# EAGLE design Ekspander (EAGLE 9.3.0)
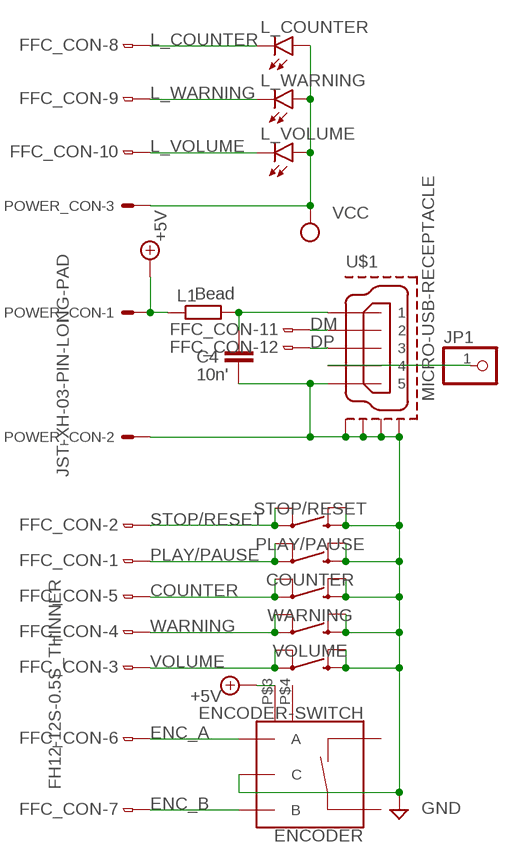
[diagram p0: schematic, sheet 1]

## Parts
C4  10n'  C-EUC0402  [C0402]
COUNTER  MOMENTARY-SWITCH-SPST-PTH-12MM  [TACTILE_SWITCH_PTH_12MM]
ENCODER  ENCODER-SWITCH  [ROTARY_ENC_PLAIN]
FFC_CON  FH12-12S-0.5S_THINNER  [FH12-12S-0.5SH_THINER]
JP1  PINHD-1X1  [1X01]
L1  Bead  R-EU_R0603  [R0603]
L_COUNTER  LEDCHIPLED_0805  [CHIPLED_0805]
L_VOLUME  LEDCHIPLED_0805  [CHIPLED_0805]
L_WARNING  LEDCHIPLED_0805  [CHIPLED_0805]
PLAY/PAUSE  MOMENTARY-SWITCH-SPST-PTH-12MM  [TACTILE_SWITCH_PTH_12MM]
POWER_CON  JST-XH-03-PIN-LONG-PAD  [JST-XH-03-PACKAGE-LONG-PAD]
STOP/RESET  MOMENTARY-SWITCH-SPST-PTH-12MM  [TACTILE_SWITCH_PTH_12MM]
U$1  MICRO-USB-RECEPTACLE  [47589-0002]
VOLUME  MOMENTARY-SWITCH-SPST-PTH-12MM  [TACTILE_SWITCH_PTH_12MM]
WARNING  MOMENTARY-SWITCH-SPST-PTH-12MM  [TACTILE_SWITCH_PTH_12MM]

## Nets
+5V: ENCODER.P$3(GND1) L1.1 POWER_CON.1
COUNTER: COUNTER.1 COUNTER.2 FFC_CON.5
DM: FFC_CON.11 U$1.2
DP: FFC_CON.12 U$1.3
ENC_A: ENCODER.A FFC_CON.6
ENC_B: ENCODER.B FFC_CON.7
GND: C4.2 COUNTER.3 COUNTER.4 ENCODER.C PLAY/PAUSE.3 PLAY/PAUSE.4 POWER_CON.2 STOP/RESET.3 STOP/RESET.4 U$1.5 U$1.CASING1(GND1) U$1.CASING2(GND2) U$1.CASING3(GND3) U$1.CASING4(GND4) VOLUME.3 VOLUME.4 WARNING.3 WARNING.4
L_COUNTER: FFC_CON.8 L_COUNTER.C
L_VOLUME: FFC_CON.10 L_VOLUME.C
L_WARNING: FFC_CON.9 L_WARNING.C
N$8: JP1.1 U$1.4
N$14: C4.1 L1.2 U$1.1
PLAY/PAUSE: FFC_CON.1 PLAY/PAUSE.1 PLAY/PAUSE.2
STOP/RESET: FFC_CON.2 STOP/RESET.1 STOP/RESET.2
VCC: L_COUNTER.A L_VOLUME.A L_WARNING.A POWER_CON.3
VOLUME: FFC_CON.3 VOLUME.1 VOLUME.2
WARNING: FFC_CON.4 WARNING.1 WARNING.2
Unconnected: ENCODER.P$4(GND2) ENCODER.SW+ ENCODER.SW- FFC_CON.CASE1 FFC_CON.CASE2

## Library data of the parts
C4 = rcl:C-EU: CAPACITOR, European symbol; SPICEPREFIX: C
COUNTER PLAY/PAUSE STOP/RESET VOLUME WARNING = MySparkFun-Switches:MOMENTARY-SWITCH-SPST: Momentary Switch (Pushbutton) - SPST Normally-open (NO) SPST momentary switches (buttons, pushbuttons). Variants PTH-12MM - 12mm square, through-hole Momentary Pushbutton Switch - 12mm Square <https://www.sparkfun.com/products/9190> (COM-09190) PTH-6.0MM, PTH-6.0MM-KIT - 6.0mm square, through-hole Mini Pushbutton Switch <https://www.sparkfun.com/products/97> (COM-00097) KIT package intended for soldering kit's - only one side of pads' copper is exposed. PTH-RIGHT-ANGLE-KIT - Right-angle, through-hole Right Angle Tactile Button <https://www.sparkfun.com/products/10791> - Used on SparkFun BigTime Watch Kit <https://www.sparkfun.com/products/11734> SMD-12MM - 12mm square, surface-mount Tactile Button - SMD (12mm) <https://www.sparkfun.com/products/12993> (COM-12993) Used on SparkFun PicoBoard <https://www.sparkfun.com/products/11888> SMD-4.5MM - 4.5mm Square Trackball Switch Used on SparkFun Blackberry Trackballer Breakout <https://www.sparkfun.com/products/13169> SMD-4.6MMX2.8MM - 4.60mm x 2.80mm, surface mount Used on SparkFun SAMD21 Mini Breakout <https://www.sparkfun.com/products/13664> SMD-5.2MM, SMD-5.2-REDUNDANT - 5.2mm square, surface-mount Mini Pushbutton Switch - SMD <https://www.sparkfun.com/products/8720> (COM-08720) Used on Arduino Pro Mini <https://www.sparkfun.com/products/11114> REDUNDANT package connects both switch circuits together SMD-6.0X3.5MM - 6.0 x 3.5mm, surface mount Momentary Reset Switch SMD <https://www.sparkfun.com/products/8229> (COM-08229) SMD-6.2MM-TALL - 6.2mm square, surface mount Tactile Button - SMD (6mm) <https://www.sparkfun.com/products/12992> Used on SparkFun Digital Sandbox <https://www.sparkfun.com/products/12651> SMD-RIGHT-ANGLE - Right-angle, surface mount Used on SparkFun Block for Intel® Edison - Arduino <https://www.sparkfun.com/products/13036>; PROD_ID: SWCH-09185; SF_SKU: COM-09190
ENCODER = MySparkFun-Switches:ENCODER-SWITCH: Rotary Encoder w/ Select Switch Encoders rotate similarly to potentiometers, but they’re different from potentiometers in that an encoder has full rotation without limits. They output gray code so that you can tell how much and in which direction the encoder has been turned. This encoder includes a push-down select switch built into the shaft. SparkFun Products Rotary Encoder <https://www.sparkfun.com/products/9117> (COM-09117); SF_SKU: COM-09117
FFC_CON = My_con-hirose:FH12-12S-0.5S_THINNER: 0.5mm Pitch Connectors For FPC/FFC Source: Data sheet <http://www.hirose.co.jp/cataloge_hp/e58605370.pdf>
JP1 = pinhead:PINHD-1X1: PIN HEADER
L1 = rcl:R-EU_: RESISTOR, European symbol; SPICEPREFIX: R
L_COUNTER L_VOLUME L_WARNING = led:LED: LED OSRAM: - CHIPLED LG R971, LG N971, LY N971, LG Q971, LY Q971, LO R971, LY R971 LH N974, LH R974 LS Q976, LO Q976, LY Q976 LO Q996 - Hyper CHIPLED LW Q18S LB Q993, LB Q99A, LB R99A - SideLED LS A670, LO A670, LY A670, LG A670, LP A670 LB A673, LV A673, LT A673, LW A673 LH A674 LY A675 LS A676, LA A676, LO A676, LY A676, LW A676 LS A679, LY A679, LG A679 - Hyper Micro SIDELED® LS Y876, LA Y876, LO Y876, LY Y876 LT Y87S - SmartLED LW L88C, LW L88S LB L89C, LB L89S, LG L890 LS L89K, LO L89K, LY L89K LS L896, LA L896, LO L896, LY L896 - TOPLED LS T670, LO T670, LY T670, LG T670, LP T670 LSG T670, LSP T670, LSY T670, LOP T670, LYG T670 LG T671, LOG T671, LSG T671 LB T673, LV T673, LT T673, LW T673 LH T674 LS T676, LA T676, LO T676, LY T676, LB T676, LH T676, LSB T676, LW T676 LB T67C, LV T67C, LT T67C, LS T67K, LO T67K, LY T67K, LW E67C LS E67B, LA E67B, LO E67B, LY E67B, LB E67C, LV E67C, LT E67C LW T67C LS T679, LY T679, LG T679 LS T770, LO T770, LY T770, LG T770, LP T770 LB T773, LV T773, LT T773, LW T773 LH T774 LS E675, LA E675, LY E675, LS T675 LS T776, LA T776, LO T776, LY T776, LB T776 LHGB T686 LT T68C, LB T68C - Hyper Mini TOPLED® LB M676 - Mini TOPLED Santana® LG M470 LS M47K, LO M47K, LY M47K Source: http://www.osram.convergy.de LUXEON: - LUMILED® LXK2-PW12-R00, LXK2-PW12-S00, LXK2-PW14-U00, LXK2-PW14-V00 LXK2-PM12-R00, LXK2-PM12-S00, LXK2-PM14-U00 LXK2-PE12-Q00, LXK2-PE12-R00, LXK2-PE12-S00, LXK2-PE14-T00, LXK2-PE14-U00 LXK2-PB12-K00, LXK2-PB12-L00, LXK2-PB12-M00, LXK2-PB14-N00, LXK2-PB14-P00, LXK2-PB14-Q00 LXK2-PR12-L00, LXK2-PR12-M00, LXK2-PR14-Q00, LXK2-PR14-R00 LXK2-PD12-Q00, LXK2-PD12-R00, LXK2-PD12-S00 LXK2-PH12-R00, LXK2-PH12-S00 LXK2-PL12-P00, LXK2-PL12-Q00, LXK2-PL12-R00 Source: www.luxeon.com KINGBRIGHT: KA-3528ASYC Source: www.kingbright.com
POWER_CON = Rembrandt Electronics - JST XH Connectors v1-0:JST-XH-03-PIN: JST XH Connector 2 Pin Wire to board connector. Pitch: 2,54 mm, (0.100") Number of pins: 3 Created by Rembrandt Electronics www.rembrandtelectronics.com
U$1 = con-molex-usb:MICRO-USB-RECEPTACLE: MICRO USB RECEPTACLES Micro-USB Receptacles, SMT, Lead-Free from MOLEX <http://www.molex.com/>. (C) 2014 Tomasz Boleslaw CEDRO, cederom@tlen.pl, http://www.tomek.cedro.info. Version 0.1 (2014-01-17): Initial release. Version 0.2 (2014-02-06): Updated 47589-0001 footprint pins/pads/milling. Following devices are included: 1. 47589-0001 Micro-USB AB Receptacle, Bottom Mount, SMT, Lead-Free <http://www.molex.com/molex/products/datasheet.jsp?part=active/0475890001_IO_CONNECTORS.xml> (Technical Drawing <http://www.molex.com/pdm_docs/sd/475890001_sd.pdf>).

## Board
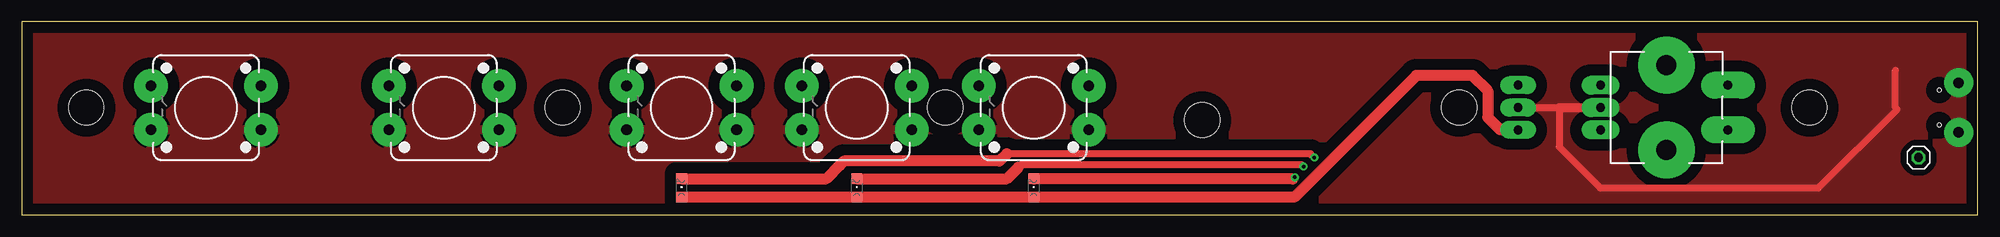
[diagram p1: board, top side]
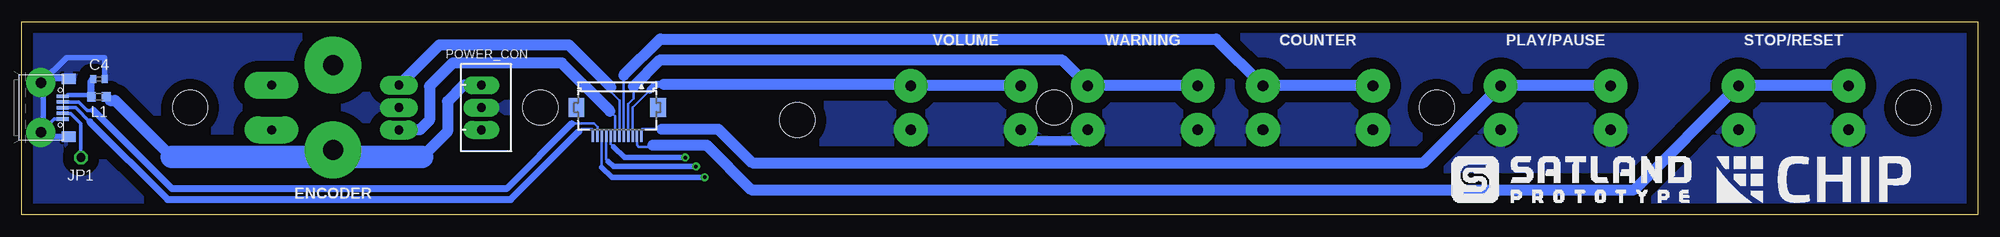
[diagram p2: board, bottom side, seen from below]

Size 222.3 x 21.95 mm. Coordinates in mm from the lower left corner, seen from the top.
Outline: 0,0 222.3,0 222.3,21.95 0,21.95 0,0
Copper layers (1*16): Top 0.035mm / dielectric 1.5mm / Bottom 0.035mm
Design rules "default *": minimum track width 10mil, minimum drill 0.4mm, track to track 8mil, track to pad 8mil, pad to pad 8mil, via to via 10mil, smd to smd 10mil, copper to edge 10mil, drill to drill 10mil, minimum pad ring 10mil, minimum via ring 10mil, stop-mask expansion 4mil, vias tented up to drill 36mil, thermal gap 10mil
Holes 4 mm at 61.47,12.19 134.16,10.77 104.95,12.19 163.37,12.19 203.2,12.19 7.32,12.19

### Footprints (pad centres in the part's own frame; a part is rotated, then mirrored left to right if it is on the bottom)
C0402 = smd 0.7 x 0.9: 1 -0.65,0; 2 0.65,0
TACTILE_SWITCH_PTH_12MM = drill 1.2 pad 3.81: 1 6.25,-2.5; 2 -6.25,-2.5; 3 6.25,2.5; 4 -6.25,2.5
ROTARY_ENC_PLAIN = drill 1.016 pad 2.159 long: A 7.493,-2.54; B 7.493,2.54; C 7.493,0 | drill 2.286 pad 6.452: P$3 0,4.826; P$4 0,-4.826 | drill 1.016 pad 3.048 long: SW+ -6.985,2.54; SW- -6.985,-2.54
FH12-12S-0.5SH_THINER = smd 0.29 x 1.3: 1 -2.75,3.25; 2 -2.25,3.25; 3 -1.75,3.25; 4 -1.25,3.25; 5 -0.75,3.25; 6 -0.25,3.25; 7 0.25,3.25; 8 0.75,3.25; 9 1.25,3.25; 10 1.75,3.25; 11 2.25,3.25; 12 2.75,3.25 | smd 1.8 x 2.2: CASE1 -4.65,0; CASE2 4.65,0
1X01 = drill 1.016 octagon: 1 0,0
R0603 = smd 1 x 1.1: 1 -0.85,0; 2 0.85,0
CHIPLED_0805 = smd 1.2 x 1.2: A 0,-1.05; C 0,1.05
JST-XH-03-PACKAGE-LONG-PAD = drill 1.016 pad 2.032 long: 1 -2.54,0; 2 0,0; 3 2.54,0
47589-0002 = smd 1.35 x 0.4: 1 2.8,1.3; 2 2.8,0.65; 3 2.8,0; 4 2.8,-0.65; 5 2.8,-1.3 | drill 1.2 pad 3.302: CASING1 0.325,2.825; CASING2 0.325,-2.825 | smd 1.6 x 1.2: CASING3 3.475,3.3; CASING4 3.475,-3.3 | hole 0.45: 2.525,2; 2.525,-2

### Placement (x,y rotation side)
C4  213.56,15.44 0 bottom
COUNTER  74.98,12.19 180 top
ENCODER  186.94,12.19 180 top
FFC_CON  154.64,12.19 180 bottom
JP1  215.6,6.5 0 top
L1  213.56,13.41 180 bottom
L_COUNTER  74.98,3.05 0 top
L_VOLUME  115.01,3.05 0 top
L_WARNING  94.89,3.05 0 top
PLAY/PAUSE  47.96,12.19 180 top
POWER_CON  170.08,12.19 270 bottom
STOP/RESET  20.93,12.19 180 top
U$1  220.47,12.19 0 bottom
VOLUME  115.01,12.19 180 top
WARNING  94.89,12.19 180 top

### Tracks (layer width: path | path; a pad name or v marks a point on that pad's centre or on a via)
+5V
  Bottom 0.61: L1.1 212.32,13.02 | ENCODER.P$3 186.94,6.57
  Bottom 1.27: 176.82,6.57 173.94,9.45 173.94,12.9 172.11,14.73 POWER_CON.1 | 212.32,13.02 211.72,13.02 205.26,6.57
  Bottom 2.54: 176.82,6.57 186.94,6.57 205.26,6.57
COUNTER
  Bottom 0.29: FFC_CON.5 153.88,15.88
  Bottom 1.27: COUNTER.1 COUNTER.2 86.55,20.01 149.76,20.01 153.88,15.88
DM
  Bottom 0.29: FFC_CON.11 156.88,9.97 157.28,10.36 159.82,10.36
  Bottom 0.394: U$1.2 215.84,12.84 214.88,11.89 214.17,11.89
  Bottom 0.813: 159.82,10.36 167.23,2.95 205.23,2.95 214.17,11.89
DP
  Bottom 0.29: 159,9.45 158.7,9.75 157.48,9.75 157.38,9.66 FFC_CON.12
  Bottom 0.394: U$1.3 216.21,12.19 214.58,10.57
  Bottom 0.813: 214.58,10.57 205.74,1.73 166.73,1.73 159,9.45
ENC_A
  Bottom 0.29: FFC_CON.6 154.38,13 155.35,13.97 155.35,14.53
  Bottom 1.27: 155.35,14.53 160.12,19.3 174.88,19.3 ENCODER.A
ENC_B
  Bottom 0.29: FFC_CON.7 154.88,11.22 155.45,11.79
  Bottom 1.27: ENCODER.B 177.09,9.65 175.97,10.77 175.97,14.63 173.33,17.27 160.93,17.27 155.45,11.79
GND
  Top 0.813: POWER_CON.2 174.75,12.19 174.75,7.72 179.43,3.05 204.22,3.05 213.16,11.99 212.95,12.19 212.95,16.46
  Top 1.016: 174.75,12.19 ENCODER.C
  Bottom 0.394: U$1.5 218.62,10.89 U$1.CASING2
  Bottom 0.61: U$1.CASING3 219.67,15.49 U$1.CASING1 | U$1.CASING4 219.67,8.89 U$1.CASING2 219.86,9.65 219.86,14.73 U$1.CASING1 | C4.2 212.91,17.84 212.95,17.88 217.22,17.88 220.09,15.02 U$1.CASING1
  Bottom 1.016: WARNING.4 101.14,8.41 108.76,8.41 VOLUME.3
  pour Bottom (isolate 1.27): 0,21.95 222.3,21.95 222.3,0 0,0
  pour Top (isolate 1.27): 222.3,21.95 0,21.95 0,0 222.3,0
L_COUNTER  (via drill 0.4)
  Top 0.813: 111.96,6.94 146.47,6.94 v146.91,6.5
  Top 1.27: L_COUNTER.C 91.44,4.1 92.95,5.6 93.44,6.1 111.12,6.1 111.96,6.94
  Bottom 0.29: FFC_CON.8 155.38,8.07 155.04,7.72
  Bottom 0.61: 155.04,7.72 153.82,6.5 v146.91,6.5
L_VOLUME  (via drill 0.4)
  Top 0.813: v144.68,4.27 144.47,4.06
  Top 1.27: 144.47,4.06 115.05,4.06 L_VOLUME.C
  Bottom 0.29: FFC_CON.10 156.38,5.41
  Bottom 0.61: 156.38,5.41 155.25,4.27 v144.68,4.27
L_WARNING  (via drill 0.4)
  Top 0.813: v145.69,5.49 145.49,5.69 113.56,5.69 113.27,5.4
  Top 1.27: L_WARNING.C 111.96,4.1 113.27,5.4
  Bottom 0.29: FFC_CON.9 155.88,6.3 155.67,6.08
  Bottom 0.61: 155.67,6.08 155.07,5.49 v145.69,5.49
N$8
  Bottom 0.394: U$1.4 216.77,11.54 215.59,10.36 JP1.1
N$14
  Bottom 0.254: U$1.1 217.56,13.6 217.12,13.6
  Bottom 0.508: 217.12,13.6 214.61,13.6 L1.2
  Bottom 0.813: L1.2 214.41,15.24 C4.1
PLAY/PAUSE
  Bottom 0.254: 54.2,14.68 PLAY/PAUSE.2
  Bottom 0.29: FFC_CON.1 151.88,9.66 151.79,9.75 149.56,9.75
  Bottom 1.27: PLAY/PAUSE.1 PLAY/PAUSE.2 | 149.56,9.75 143.15,9.75 139.29,5.89 62.99,5.89 54.2,14.68
STOP/RESET
  Bottom 0.254: 152.38,7.93 152.38,8.74
  Bottom 0.29: 152.38,8.74 FFC_CON.2 152.38,7.93 152.18,7.72 150.77,7.72 150.57,7.92
  Bottom 1.27: STOP/RESET.1 STOP/RESET.2 39.03,2.84 139.4,2.84 144.47,7.92 150.57,7.92
VCC
  Top 1.27: L_COUNTER.A L_WARNING.A L_VOLUME.A 144.64,2 158.5,15.85 164.9,15.85 166.62,14.12 166.62,11.07 168.05,9.65 POWER_CON.3
VOLUME
  Bottom 0.29: FFC_CON.3 152.88,12.19 150.93,14.15 150.93,14.18
  Bottom 0.813: 149.35,14.85 150.26,14.85 150.93,14.18
  Bottom 1.27: VOLUME.1 VOLUME.2 121.26,14.81 121.31,14.85 149.35,14.85
WARNING
  Bottom 0.29: FFC_CON.4 153.38,12.6 152.78,13.2 152.78,14.61
  Bottom 1.27: WARNING.1 WARNING.2 104.08,17.63 149.76,17.63 152.78,14.61